# Altium schematic sheet Flow_sensor.SchDoc
size 420 x 297 mm; Address1: Address1; Address2: Address2; Address3: Address3; Address4: Address4; DocumentNumber: *Э3; SheetNumber: 4; SheetTotal: 12; DocumentType: Схема электрическая *
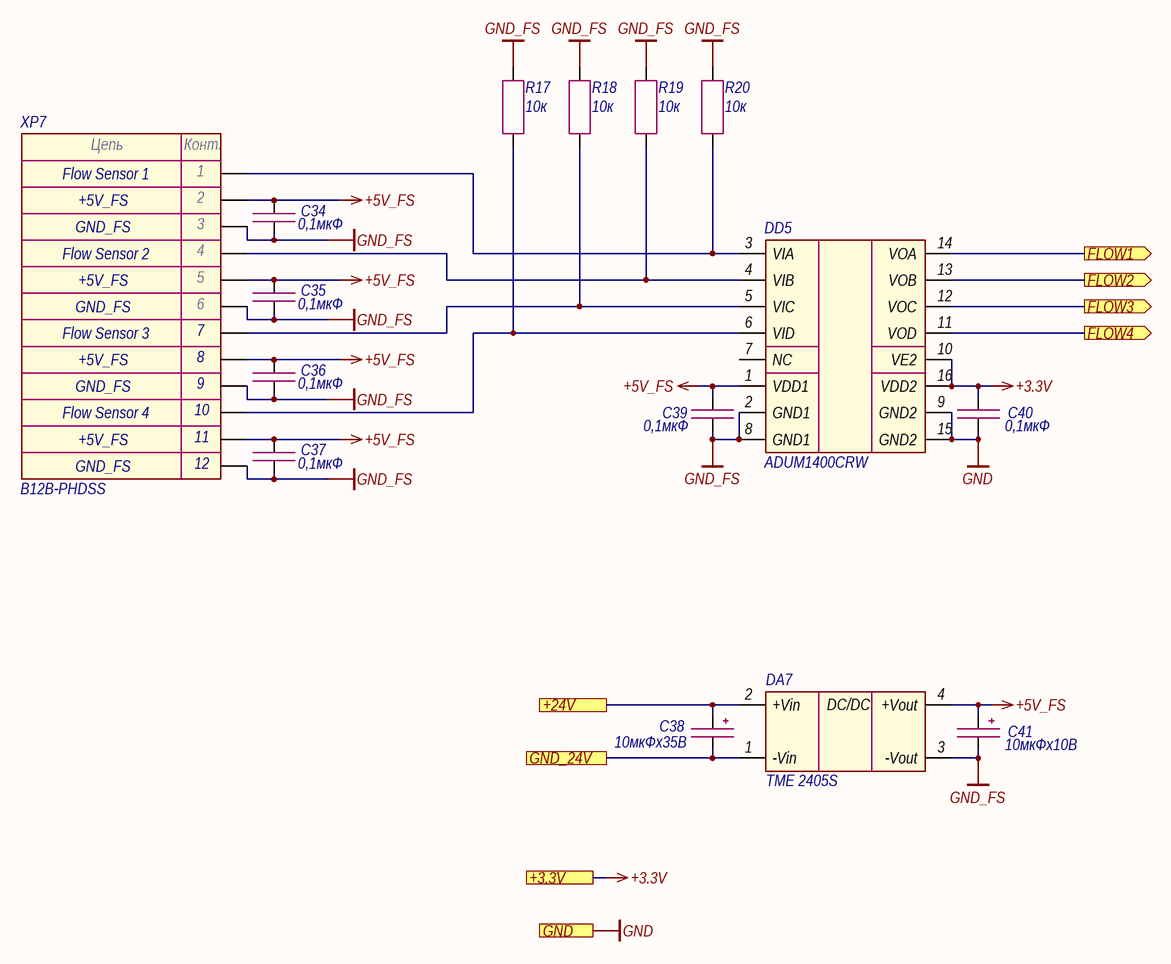
[diagram p0: Flow_sensor.SchDoc]

## Parts
C34  0,1мкФ  [CAP_0603]
C35  0,1мкФ  [CAP_0603]
C36  0,1мкФ  [CAP_0603]
C37  0,1мкФ  [CAP_0603]
C38  10мкФх35B  [CAP_C]
C39  0,1мкФ  [CAP_0603]
C40  0,1мкФ  [CAP_0603]
C41  10мкФх10B  [CAP_A]
DA7  TME 2405S  [TME (SIP-4)]
DD5  ADUM1400CRW  [SOIC-16W]
R17  10к  [RES_0603]
R18  10к  [RES_0603]
R19  10к  [RES_0603]
R20  10к  [RES_0603]
XP7  B12B-PHDSS  [B12B-PHDSS]

## Ports
+3.3V (see Main[1B], Bus[1D], Button[1D], Ethernet[3D], Fiber_interlock[2C], Hardwiring[3D]), +24V (see Main[1A], Bus[1D], Button[1C], Column[1C], Hardwiring[3C], Indication[1C]), FLOW1 (out, see Main[2A]), FLOW2 (out, see Main[2A]), FLOW3 (out, see Main[2B]), FLOW4 (out, see Main[2B]), GND (see Main[1B], Bus[1D], Button[1D], Column[1C], Ethernet[3D], Fiber_interlock[2C], Guide_laser[1C], Hardwiring[3D], Indication[1C]), GND_24V (see Main[1A], Bus[1D], Button[1D], Column[1C], Hardwiring[3C], Indication[1C])

## Nets
+3.3V: C40.1 DD5.10(VE2) DD5.16(VDD2) ; port +3.3V
+5V_FS: C34.1 C35.1 C36.1 C37.1 C39.1 C41.1 DA7.4(+Vout) DD5.1(VDD1) XP7.2 XP7.5 XP7.8 XP7.11
GND: C40.2 DD5.9(GND2) DD5.15(GND2) ; port GND
GND_FS: C34.2 C35.2 C36.2 C37.2 C39.2 C41.2 DA7.3(-Vout) DD5.2(GND1) DD5.8(GND1) R17.2 R18.2 R19.2 R20.2 XP7.3 XP7.6 XP7.9 XP7.12
+24V: C38.1 DA7.2(+Vin) ; port +24V
FLOW1: DD5.14(VOA) ; port FLOW1
FLOW2: DD5.13(VOB) ; port FLOW2
FLOW3: DD5.12(VOC) ; port FLOW3
FLOW4: DD5.11(VOD) ; port FLOW4
GND_24V: C38.2 DA7.1(-Vin) ; port GND_24V
NetDD5_3: DD5.3(VIA) R20.1 XP7.1
NetDD5_4: DD5.4(VIB) R19.1 XP7.4
NetDD5_5: DD5.5(VIC) R18.1 XP7.7
NetDD5_6: DD5.6(VID) R17.1 XP7.10

Not connected (* = marked no-connect by the designer): DD5 7(NC)

## Notes on the sheet
- Flow Sensor 1
- +5V_FS
- GND_FS
- Flow Sensor 2
- Flow Sensor 3
- Flow Sensor 4
- Подп. и дата
- Инв. № дубл.
- Взам. инв. №
- Инв. № подл.
- Изм.
- Лист
- № докум.
- Подп.
- Дата
- Копировал
- Формат А3
- (in symbol Connector-12) Цепь; Конт.
- (in symbol TME) DC/DC

## Library data of the parts
C34-C37 C39 C40 = Capacitor: Manufacturer: Murata; Model: GRM188R71H104KA93D; Value: 0,1мкФ; Document: *
C38 = Capacitor_Polar: Model: TECAP, 10 мкФ, 35 В, тип C, 10%; Value: 10мкФх35B; Document: *; Manufacturer: *
C41 = Capacitor_Polar: Model: TECAP, 10 мкФ, 10 В, тип A, 10%; Value: 10мкФх10B; Document: *; Manufacturer: *
DA7 = TME: Manufacturer: Traco Power; Model: TME 2405S; Document: *
DD5 = ADUM1400: Manufacturer: Analog Devices; Model: ADUM1400CRW; Document: *
R17-R20 = Resistor: Manufacturer: Yageo; Model: RC0603FR-0710KL; Value: 10к; Document: *
XP7 = Connector-12: Manufacturer: JST; Model: B12B-PHDSS; Document: *